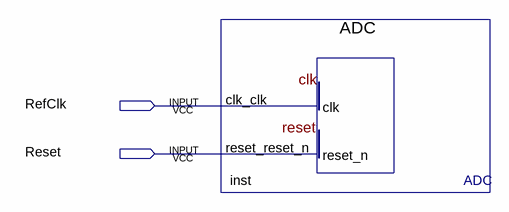
[diagram p0: schematic sheet]
// Quartus schematic MaxADC.bdf as structural Verilog: 1 symbols, 2 pins
module MaxADC (
  input  RefClk,
  input  Reset
);

  ADC inst (.clk_clk(RefClk), .reset_reset_n(Reset));
endmodule
